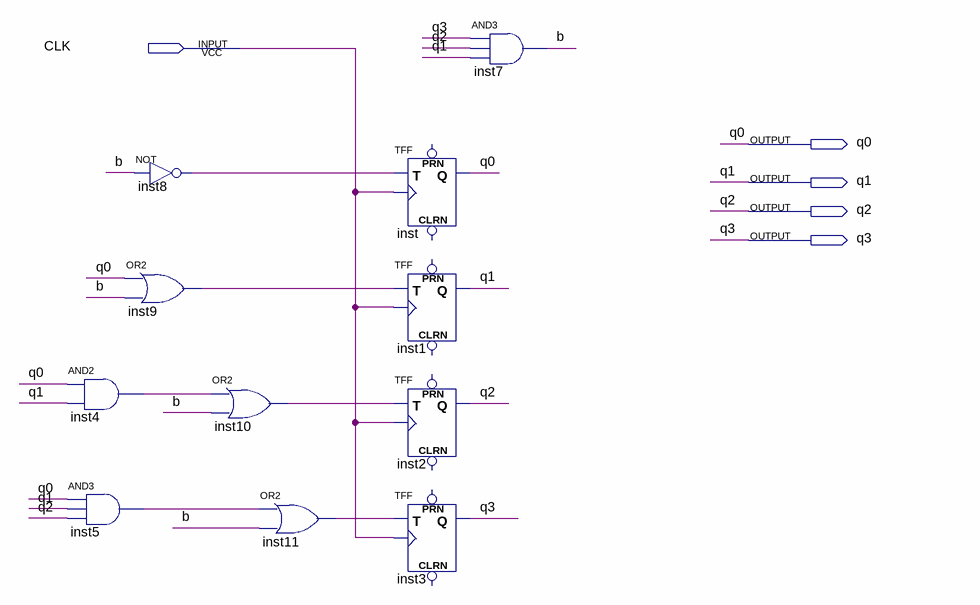
[diagram p0: schematic sheet]
// Quartus schematic lab3.bdf as structural Verilog: 11 symbols, 5 pins
module lab3 (
  input  CLK,
  output q0,
  output q1,
  output q2,
  output q3
);

  wire b, inst4_out, inst5_out, inst8_out, inst9_out, inst10_out, inst11_out;

  and inst4 (inst4_out, q0, q1);
  and inst5 (inst5_out, q0, q1, q2);
  not inst8 (inst8_out, b);
  or inst9 (inst9_out, q0, b);
  or inst10 (inst10_out, inst4_out, b);
  or inst11 (inst11_out, inst5_out, b);
  TFF inst (.T(inst8_out), .CLK(CLK), .Q(q0));  // open: PRN, CLRN
  TFF inst1 (.T(inst9_out), .CLK(CLK), .Q(q1));  // open: PRN, CLRN
  TFF inst2 (.T(inst10_out), .CLK(CLK), .Q(q2));  // open: PRN, CLRN
  TFF inst3 (.T(inst11_out), .CLK(CLK), .Q(q3));  // open: PRN, CLRN
  and inst7 (b, q3, q2, q1);
endmodule
